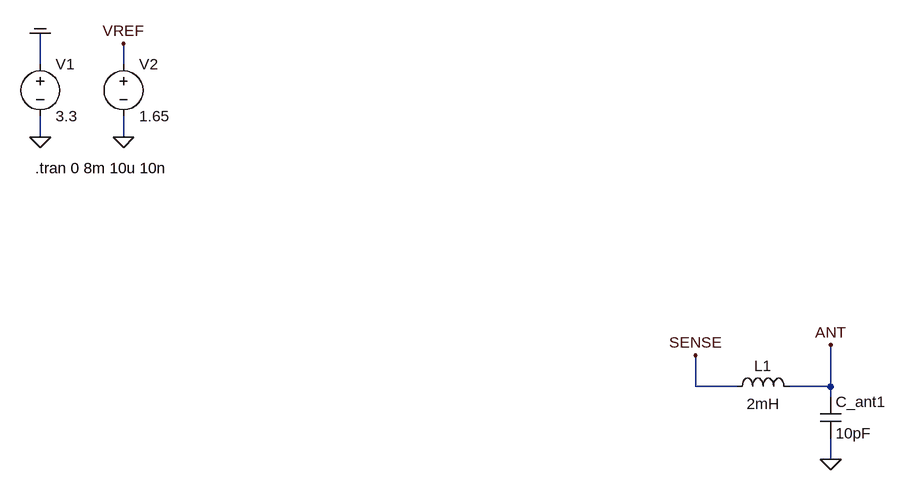
[diagram p0: schematic Draft1.asc]
Draft1.asc, the LTspice schematic file:
Version 4
SHEET 1 1452 896
WIRE 144 272 144 224
WIRE 272 272 272 240
WIRE 144 384 144 352
WIRE 272 384 272 352
WIRE 1152 768 1152 720
WIRE 1216 768 1152 768
WIRE 1360 768 1360 704
WIRE 1360 768 1296 768
WIRE 1360 784 1360 768
WIRE 1360 880 1360 848
FLAG 144 384 0
FLAG 144 224 COM
FLAG 272 384 0
FLAG 272 240 VREF
FLAG 1360 704 ANT
FLAG 1152 720 SENSE
FLAG 1360 880 0
SYMBOL voltage 144 256 R0
SYMATTR InstName V1
SYMATTR Value 3.3
SYMBOL Voltage 272 256 R0
SYMATTR InstName V2
SYMATTR Value 1.65
SYMBOL ind 1200 784 R270
WINDOW 0 32 56 VTop 2
WINDOW 3 5 56 VBottom 2
SYMATTR InstName L1
SYMATTR Value 2mH
SYMATTR SpiceLine Rser=120 Cpar=1pF
SYMBOL Cap 1344 784 R0
SYMATTR InstName C_ant1
SYMATTR Value 10pF
TEXT 136 432 Left 2 !.tran 0 8m 10u 10n

The netlist it stands for:
* Draft1.asc
V1 COM 0 3.3
V2 VREF 0 1.65
L1 SENSE ANT 2mH Rser=120 Cpar=1pF
C_ant1 ANT 0 10pF
.tran 0 8m 10u 10n
.backanno
.end